# Altium project bldcDriver.PrjPCB
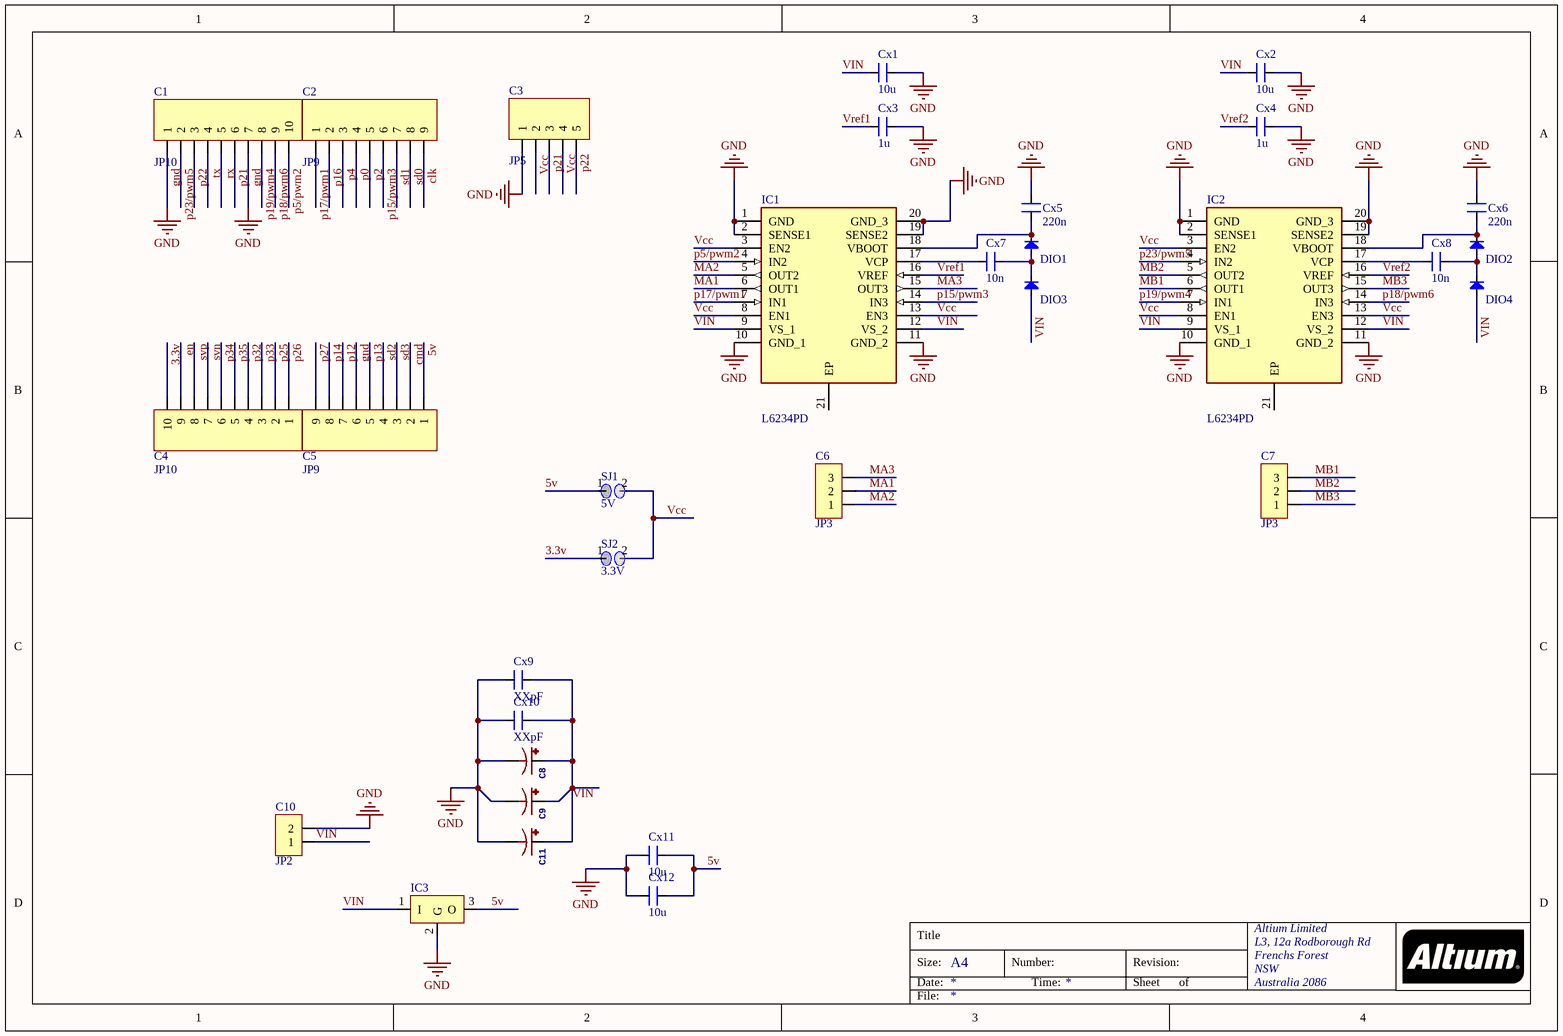
[diagram p0: schematic.SchDoc]
1 sheet, 32 parts. Net scope: global (net labels, ports and power ports of the same name join across sheets).
Board file: PCB.PcbDoc

## Sheet schematic.SchDoc
size A4; Organization: Altium Limited; Address1: L3, 12a Rodborough Rd; Address2: Frenchs Forest; Address3: NSW; Address4: Australia 2086

### Parts
C1  JP10  [JP10-C1T]
C2  JP9  [JP9-C1T]
C3  JP5  [JP5-D1T]
C4  JP10  [JP10-C1T]
C5  JP9  [JP9-C1T]
C6  JP3  [JP3-D1C]
C7  JP3  [JP3-D1C]
C8  (no value)  [EIA3528]
C9  (no value)  [EIA3528]
C10  JP2  [JP2-D1C]
C11  (no value)  [EIA3528]
Cx1  10u  [CN-SMD-0603]
Cx2  10u  [CN-SMD-0603]
Cx3  1u  [CN-SMD-0603]
Cx4  1u  [CN-SMD-0603]
Cx5  220n  [CN-SMD-0603]
Cx6  220n  [CN-SMD-0603]
Cx7  10n  [CN-SMD-0603]
Cx8  10n  [CN-SMD-0603]
Cx9  XXpF  [CN-SMD-1206]
Cx10  XXpF  [CN-SMD-1206]
Cx11  10u  [CN-SMD-0603]
Cx12  10u  [CN-SMD-0603]
DIO1  Diode SMD  [DIO-SMD-123]  (value not drawn)
DIO2  Diode SMD  [DIO-SMD-123]  (value not drawn)
DIO3  Diode SMD  [DIO-SMD-123]  (value not drawn)
DIO4  Diode SMD  [DIO-SMD-123]  (value not drawn)
IC1  L6234PD  [SOIC127P1420X360-21N]
IC2  L6234PD  [SOIC127P1420X360-21N]
IC3  LM78xx  [TO252-123]  (value not drawn)
SJ1  5V  [SJ-SMD]
SJ2  3.3V  [SJ-SMD]

### Nets
gnd: C1.1 C1.7 C3.1 C5.6 C8.C(-) C9.C(-) C10.2 C11.C(-) Cx1.2 Cx2.2 Cx3.2 Cx4.2 Cx5.2 Cx6.2 Cx9.1 Cx10.1 Cx11.1 Cx12.1 IC1.1(GND) IC1.2(SENSE1) IC1.10(GND_1) IC1.11(GND_2) IC1.19(SENSE2) IC1.20(GND_3) IC2.1(GND) IC2.2(SENSE1) IC2.10(GND_1) IC2.11(GND_2) IC2.19(SENSE2) IC2.20(GND_3) IC3.2(G)
3.3v: C4.10 SJ2.1
5v: C5.1 Cx11.2 Cx12.2 IC3.3(O) SJ1.1
clk: C2.9
cmd: C5.2
en: C4.9
MA1: C6.2 IC1.6(OUT1)
MA2: C6.1 IC1.5(OUT2)
MA3: C6.3 IC1.15(OUT3)
MB1: C7.3 IC2.6(OUT1)
MB2: C7.2 IC2.5(OUT2)
MB3: C7.1 IC2.15(OUT3)
p0: C2.4
p2: C2.5
p4: C2.3
p5/pwm2: C1.10 IC1.4(IN2)
p12: C5.7
p13: C5.5
p14: C5.8
p15/pwm3: C2.6 IC1.14(IN3)
p16: C2.2
p17/pwm1: C2.1 IC1.7(IN1)
p18/pwm6: C1.9 IC2.14(IN3)
p19/pwm4: C1.8 IC2.7(IN1)
p21: C1.6 C3.3
p22: C1.3 C3.5
p23/pwm5: C1.2 IC2.4(IN2)
p25: C4.2
p26: C4.1
p27: C5.9
p32: C4.4
p33: C4.3
p34: C4.6
p35: C4.5
rx: C1.5
sd0: C2.8
sd1: C2.7
sd2: C5.4
sd3: C5.3
svn: C4.7
svp: C4.8
tx: C1.4
Vcc: C3.2 C3.4 IC1.3(EN2) IC1.8(EN1) IC1.13(EN3) IC2.3(EN2) IC2.8(EN1) IC2.13(EN3) SJ1.2 SJ2.2
VIN: C8.A(+) C9.A(+) C10.1 C11.A(+) Cx1.1 Cx2.1 Cx9.2 Cx10.2 DIO3.1(A) DIO4.1(A) IC1.9(VS_1) IC1.12(VS_2) IC2.9(VS_1) IC2.12(VS_2) IC3.1(I)
Vref1: Cx3.1 IC1.16(VREF)
Vref2: Cx4.1 IC2.16(VREF)
NetCx5_1: Cx5.1 DIO1.2(K) IC1.18(VBOOT)
NetCx6_1: Cx6.1 DIO2.2(K) IC2.18(VBOOT)
NetCx7_1: Cx7.1 IC1.17(VCP)
NetCx7_2: Cx7.2 DIO1.1(A) DIO3.2(K)
NetCx8_1: Cx8.1 IC2.17(VCP)
NetCx8_2: Cx8.2 DIO2.1(A) DIO4.2(K)

Not connected (* = marked no-connect by the designer): IC1 21(EP); IC2 21(EP)

### Notes on the sheet
- Title
- Size:
- Date:
- A4
- Number:
- Time:
- Revision:
- Sheet
- of
- File:

### Library data of the parts
C1 C4 = JP10: WR-PHD 2.54 mm Angled Socket Header; Manufacturer: W¨¹rth Elektronik eiSos GmbH; partNo: 613010143121; ComponentLink1 Description: Manufacturer; ComponentLink2 Description: Datasheet; NoPins: 10; Created Date: 29 March 2013; ComponentLink1URL: http://www.we-online.com; ComponentLink2URL: http://katalog.we-online.de/em/datasheet/6130xx143121.pdf; Created by: Karrer Zheng
C2 C5 = JP9: WR-PHD 2.54 mm Angled Socket Header; Manufacturer: W¨¹rth Elektronik eiSos GmbH; partNo: 613009143121; ComponentLink1 Description: Manufacturer; ComponentLink2 Description: Datasheet; NoPins: 09; Created Date: 29 March 2013; ComponentLink1URL: http://www.we-online.com; ComponentLink2URL: http://katalog.we-online.de/em/datasheet/6130xx143121.pdf; Created by: Karrer Zheng
C3 = JP5: WR-PHD 2.54 mm Angled Socket Header; Manufacturer: W¨¹rth Elektronik eiSos GmbH; partNo: 613005143121; ComponentLink1 Description: Manufacturer; ComponentLink2 Description: Datasheet; NoPins: 05; Created Date: 29 March 2013; ComponentLink1URL: http://www.we-online.com; ComponentLink2URL: http://katalog.we-online.de/em/datasheet/6130xx143121.pdf; Created by: Karrer Zheng
C6 C7 = JP3: WR-PHD 2.54 mm Angled Socket Header; Manufacturer: W¨¹rth Elektronik eiSos GmbH; partNo: 613003143121; ComponentLink1 Description: Manufacturer; ComponentLink2 Description: Datasheet; NoPins: 03; Created Date: 29 March 2013; ComponentLink1URL: http://www.we-online.com; ComponentLink2URL: http://katalog.we-online.de/em/datasheet/6130xx143121.pdf; Created by: Karrer Zheng
C8 C9 C11 = 47UF-POLAR-EIA3528-10V-10%: GateName_1: G$1; SymbolName_1: CAP_POL; PROD_ID: CAP-08310; DeviceName: -EIA3528-10V-10%; LibraryName: SparkFun-Capacitors; DeviceSetName: 47UF-POLAR; Package: EIA3528
C10 = JP2: WR-PHD 2.54 mm Angled Socket Header; Manufacturer: W¨¹rth Elektronik eiSos GmbH; partNo: 613002143121; ComponentLink1 Description: Manufacturer; ComponentLink2 Description: Datasheet; NoPins: 02; Created Date: 29 March 2013; ComponentLink1URL: http://www.we-online.com; ComponentLink2URL: http://katalog.we-online.de/em/datasheet/6130xx143121.pdf; Created by: Karrer Zheng
Cx1-Cx12 = CN: Value: 33pF
DIO1-DIO4 = Diode SMD: Default Diode; Code - JEDEC: DO-214-AB; Value: 1N5007; Published: 8-Jun-2000; Revision: July-2002: Re-released for DXP Platform.; Publisher: Altium Limited
IC1 IC2 = L6234PD: Integrated Circuit; Manufacturer_Name: STMicroelectronics; Allied_Number: 70013599; Datasheet Link: http://docs-emea.rs-online.com/webdocs/0b34/0900766b80b3486b.pdf; Height: 3.6mm; Manufacturer_Part_Number: L6234PD; Mouser Part Number: 511-L6234PD; Mouser Price/Stock: https://www.mouser.com/Search/Refine.aspx?Keyword=511-L6234PD; RS Part Number: 0456444P; RS Price/Stock: http://uk.rs-online.com/web/p/products/0456444P; Allied Price/Stock: http://www.alliedelec.com/stmicroelectronics-l6234pd/70013599/
IC3 = LM78xx: Positive Voltage Regulator; Note: Tab is connected to pin 3 (GND).; Published: 24-Aug-2001; LatestRevisionDate: 17-Jul-2002; LatestRevisionNote: Re-released for DXP Platform.; DatasheetVersion: Apr-1994; PackageVersion: Jul-1998; PackageReference: ISOWATT220AB; Publisher: Altium Limited; PackageDescription: TO, Thru-Hole, Vertical, Heatsink Mounted; 3 In-Line Leads; Pitch 2.54 mm; Pin sequence 1, 3, 2; ComponentLink1Description: Manufacturer Link; ComponentLink1URL: http://www.st.com/; ComponentLink2Description: Datasheet; ComponentLink2URL: http://www.st.com/stonline/products/literature/ds/2146/l78m05c.pdf
SJ1 SJ2 = SJ-SMD